# EAGLE design AVR_JTAG_1 (EAGLE 5.07)
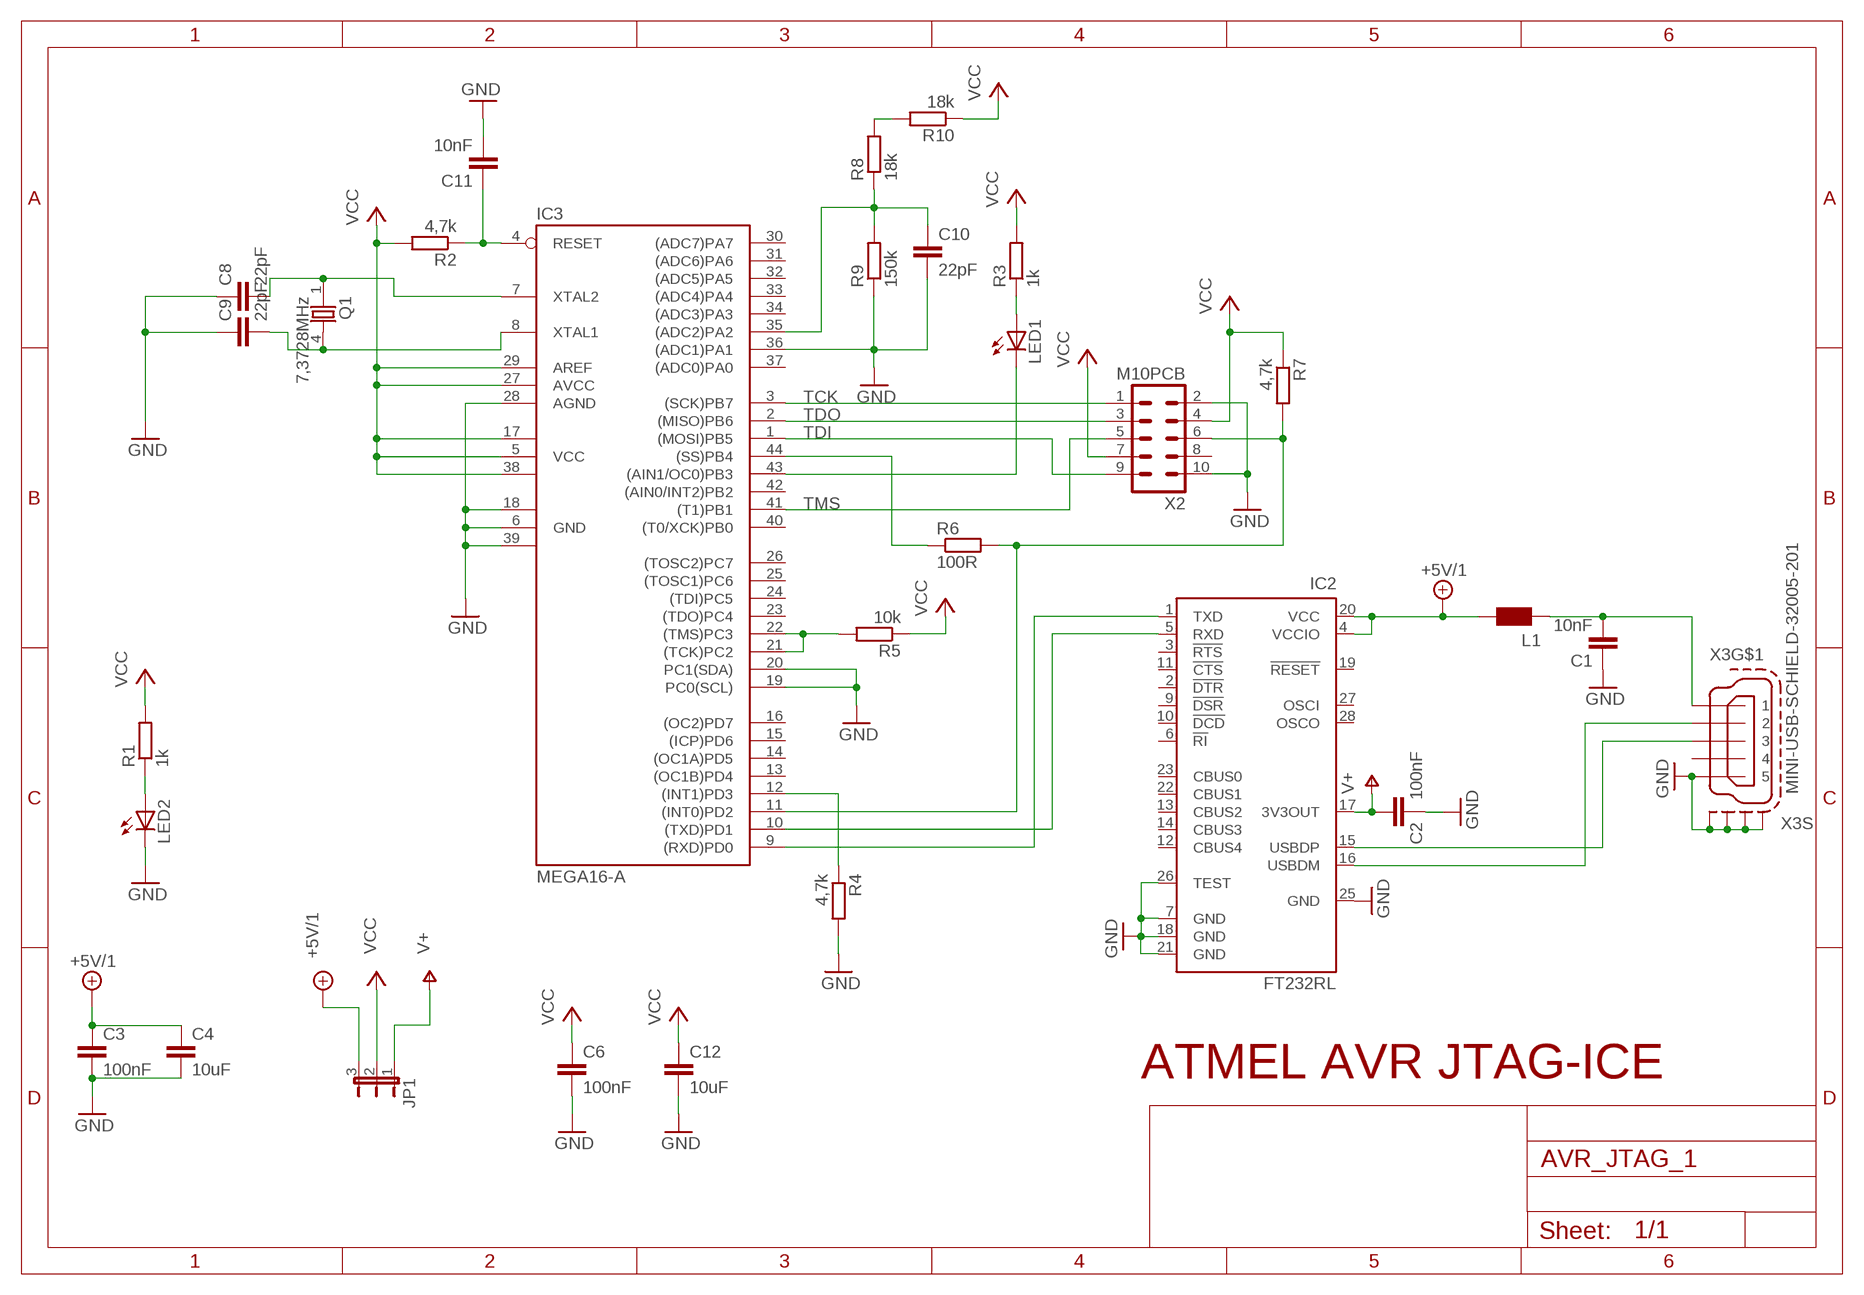
[diagram p0: schematic, sheet 1]

## Parts
C1  10nF  C-EUC1206K  [C1206K]
C2  100nF  C-EUC1206K  [C1206K]
C3  100nF  C-EUC1206K  [C1206K]
C4  10uF  C-EUC1206K  [C1206K]
C6  100nF  C-EUC1206K  [C1206K]
C8  22pF  C-EUC1206K  [C1206K]
C9  22pF  C-EUC1206K  [C1206K]
C10  22pF  C-EUC1206K  [C1206K]
C11  10nF  C-EUC1206K  [C1206K]
C12  10uF  C-EUC1206K  [C1206K]
IC2  FT232RL  [SSOP28]
IC3  MEGA16-A  [TQFP44]
JP1  JP2E  [JP2]
L1  WE-CBF_1206  [1206]
LED1  LEDP-LCC-2  [P-LCC-2]
LED2  LEDP-LCC-2  [P-LCC-2]
Q1  7,3728MHz  86SMX  [86SMX]
R1  1k  R-EU_M1206  [M1206]
R2  4,7k  R-EU_M1206  [M1206]
R3  1k  R-EU_M1206  [M1206]
R4  4,7k  R-EU_M1206  [M1206]
R5  10k  R-EU_M1206  [M1206]
R6  100R  R-EU_M1206  [M1206]
R7  4,7k  R-EU_M1206  [M1206]
R8  18k  R-EU_M1206  [M1206]
R9  150k  R-EU_M1206  [M1206]
R10  18k  R-EU_M1206  [M1206]
X2  M10PCB  ML10  [ML10]
X3  MINI-USB-SCHIELD-32005-201  [32005-201]

## Nets
+5V/1: C3.1 C4.1 IC2.4(VCCIO) IC2.20(VCC) JP1.3 L1.2
GND: C1.1 C2.1 C3.2 C4.2 C6.2 C8.1 C9.1 C10.2 C11.2 C12.2 IC2.7(GND) IC2.18(GND) IC2.21(GND) IC2.25(GND) IC2.26(TEST) IC3.6(GND) IC3.18(GND1) IC3.19(PC0(SCL)) IC3.20(PC1(SDA)) IC3.28(AGND) IC3.36((ADC1)PA1) IC3.39(GND2) LED2.C R4.2 R9.1 X2.2 X2.10 X3.5 X3.M1(S:S1) X3.M2(S:S2) X3.M3(S:S3) X3.M4(S:S4)
N$1: C9.2 IC3.8(XTAL1) Q1.4
N$2: C8.2 IC3.7(XTAL2) Q1.1
N$3: IC3.12((INT1)PD3) R4.1
N$4: IC3.43((AIN1/OC0)PB3) LED1.C
N$5: LED1.A R3.1
N$6: LED2.A R1.1
N$7: IC3.21((TCK)PC2) IC3.22((TMS)PC3) R5.2
N$8: IC2.1(TXD) IC3.9((RXD)PD0)
N$9: IC3.44((SS)PB4) R6.1
N$10: C10.1 IC3.35((ADC2)PA2) R8.1 R9.2
N$11: IC2.5(RXD) IC3.10((TXD)PD1)
N$12: R8.2 R10.2
N$13: C1.2 L1.1 X3.1
N$14: IC2.15(USBDP) X3.3
N$15: IC2.16(USBDM) X3.2
N$25: IC3.11((INT0)PD2) R6.2 R7.2 X2.6
RESET: C11.1 IC3.4(RESET) R2.1
TCK: IC3.3((SCK)PB7) X2.1
TDI: IC3.1((MOSI)PB5) X2.9
TDO: IC3.2((MISO)PB6) X2.3
TMS: IC3.41((T1)PB1) X2.5
V+: C2.2 IC2.17(3V3OUT) JP1.1
VCC: C6.1 C12.1 IC3.5(VCC) IC3.17(VCC1) IC3.27(AVCC) IC3.29(AREF) IC3.38(VCC2) JP1.2 R1.2 R2.2 R3.2 R5.1 R7.1 R10.1 X2.4 X2.7
Unconnected: IC2.2(!DTR) IC2.3(!RTS) IC2.6(!RI) IC2.9(!DSR) IC2.10(!DCD) IC2.11(!CTS) IC2.12(CBUS4) IC2.13(CBUS2) IC2.14(CBUS3) IC2.19(!RESET) IC2.22(CBUS1) IC2.23(CBUS0) IC2.27(OSCI) IC2.28(OSCO) IC3.13((OC1B)PD4) IC3.14((OC1A)PD5) IC3.15((ICP)PD6) IC3.16((OC2)PD7) IC3.23((TDO)PC4) IC3.24((TDI)PC5) IC3.25((TOSC1)PC6) IC3.26((TOSC2)PC7) IC3.30((ADC7)PA7) IC3.31((ADC6)PA6) IC3.32((ADC5)PA5) IC3.33((ADC4)PA4) IC3.34((ADC3)PA3) IC3.37((ADC0)PA0) IC3.40((T0/XCK)PB0) IC3.42((AIN0/INT2)PB2) X2.8 X3.4

## Notes on the sheet
- ATMEL AVR JTAG-ICE

## Library data of the parts
C1-C4 C6 C8-C12 = rcl:C-EU: CAPACITOR, European symbol
IC2 = ftdichip:FT232R: Source: http://www.ftdichip.com/Documents/DataSheets/DS_FT232R_v104.pdf
IC3 = atmel:MEGA16: MICROCONTROLLER 16 Kbytes FLASH 1 kbytes SRAM 512 bytes EEPROM USART 8-channel 10 bit ADC Source: avr.lbr
JP1 = jumper:JP2E: JUMPER
L1 = wuerth-elektronik:WE-CBF: SMD EMI Suppression Ferrite Beads - excellent anti-EMI properties - low DCR - impedances till 3000 ohms - rated current up to 6 A
LED1 LED2 = led:LED: LED OSRAM: - CHIPLED LG R971, LG N971, LY N971, LG Q971, LY Q971, LO R971, LY R971 LH N974, LH R974 LS Q976, LO Q976, LY Q976 LO Q996 - Hyper CHIPLED LW Q18S LB Q993, LB Q99A, LB R99A - SideLED LS A670, LO A670, LY A670, LG A670, LP A670 LB A673, LV A673, LT A673, LW A673 LH A674 LY A675 LS A676, LA A676, LO A676, LY A676, LW A676 LS A679, LY A679, LG A679 - Hyper Micro SIDELED® LS Y876, LA Y876, LO Y876, LY Y876 LT Y87S - SmartLED LW L88C, LW L88S LB L89C, LB L89S, LG L890 LS L89K, LO L89K, LY L89K LS L896, LA L896, LO L896, LY L896 - TOPLED LS T670, LO T670, LY T670, LG T670, LP T670 LSG T670, LSP T670, LSY T670, LOP T670, LYG T670 LG T671, LOG T671, LSG T671 LB T673, LV T673, LT T673, LW T673 LH T674 LS T676, LA T676, LO T676, LY T676, LB T676, LH T676, LSB T676, LW T676 LB T67C, LV T67C, LT T67C, LS T67K, LO T67K, LY T67K, LW E67C LS E67B, LA E67B, LO E67B, LY E67B, LB E67C, LV E67C, LT E67C LW T67C LS T679, LY T679, LG T679 LS T770, LO T770, LY T770, LG T770, LP T770 LB T773, LV T773, LT T773, LW T773 LH T774 LS E675, LA E675, LY E675, LS T675 LS T776, LA T776, LO T776, LY T776, LB T776 LHGB T686 LT T68C, LB T68C - Hyper Mini TOPLED® LB M676 - Mini TOPLED Santana® LG M470 LS M47K, LO M47K, LY M47K Source: http://www.osram.convergy.de LUXEON: - LUMILED® LXK2-PW12-R00, LXK2-PW12-S00, LXK2-PW14-U00, LXK2-PW14-V00 LXK2-PM12-R00, LXK2-PM12-S00, LXK2-PM14-U00 LXK2-PE12-Q00, LXK2-PE12-R00, LXK2-PE12-S00, LXK2-PE14-T00, LXK2-PE14-U00 LXK2-PB12-K00, LXK2-PB12-L00, LXK2-PB12-M00, LXK2-PB14-N00, LXK2-PB14-P00, LXK2-PB14-Q00 LXK2-PR12-L00, LXK2-PR12-M00, LXK2-PR14-Q00, LXK2-PR14-R00 LXK2-PD12-Q00, LXK2-PD12-R00, LXK2-PD12-S00 LXK2-PH12-R00, LXK2-PH12-S00 LXK2-PL12-P00, LXK2-PL12-Q00, LXK2-PL12-R00 Source: www.luxeon.com KINGBRIGHT: KA-3528ASYC Source: www.kingbright.com
Q1 = crystal:86SMX: CRYSTAL
R1-R10 = rcl:R-EU_: RESISTOR, European symbol
X2 = con-ml:ML10: HARTING
X3 = con-cypressindustries:MINI-USB-SCHIELD-: MINI USB-B Conector Source: www.cypressindustries.com

## Board
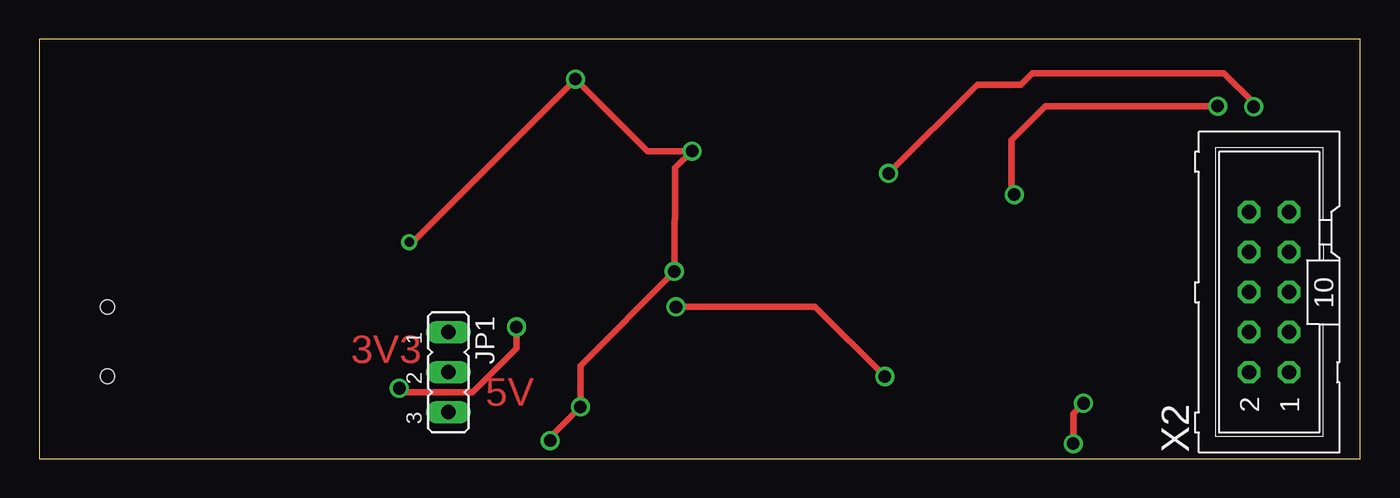
[diagram p1: board, top side]
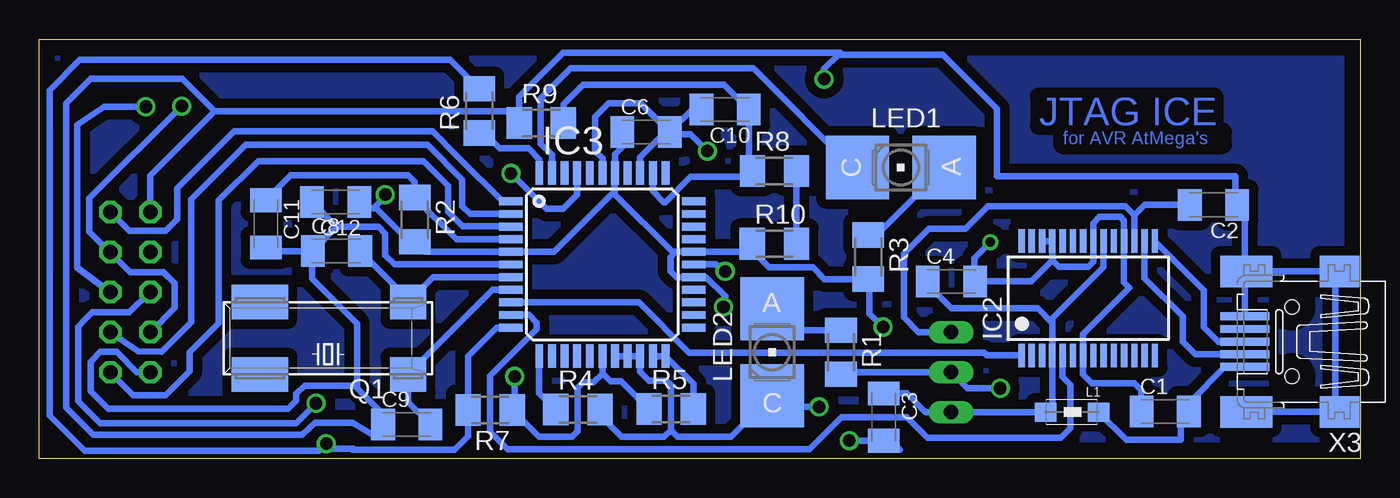
[diagram p2: board, bottom side, seen from below]

Size 83.72 x 26.56 mm. Coordinates in mm from the lower left corner, seen from the top.
Outline: 0,0 83.72,0 83.72,26.56 0,26.56 0,0
Copper layers (1*16): Top 0.035mm / dielectric 1.5mm / Bottom 0.035mm
Design rules "default": minimum track width 10mil, minimum drill 24mil, track to track 8mil, track to pad 8mil, pad to pad 8mil, via to via 8mil, smd to smd 8mil, copper to edge 40mil, drill to drill 8mil, minimum pad ring 10mil, minimum via ring 8mil, stop-mask expansion 4mil, vias tented up to drill 0mil, thermal gap 10mil

### Footprints (pad centres in the part's own frame; a part is rotated, then mirrored left to right if it is on the bottom)
C1206K = smd 1.5 x 2: 1 -1.5,0; 2 1.5,0
SSOP28 = smd 0.4 x 1.5: 1 -4.225,-3.625; 2 -3.575,-3.625; 3 -2.925,-3.625; 4 -2.275,-3.625; 5 -1.625,-3.625; 6 -0.975,-3.625; 7 -0.325,-3.625; 8 0.325,-3.625; 9 0.975,-3.625; 10 1.625,-3.625; 11 2.275,-3.625; 12 2.925,-3.625; 13 3.575,-3.625; 14 4.225,-3.625; 15 4.225,3.625; 16 3.575,3.625; 17 2.925,3.625; 18 2.275,3.625; 19 1.625,3.625; 20 0.975,3.625; 21 0.325,3.625; 22 -0.325,3.625; 23 -0.975,3.625; 24 -1.625,3.625; 25 -2.275,3.625; 26 -2.925,3.625; 27 -3.575,3.625; 28 -4.225,3.625
TQFP44 = smd 1.5 x 0.5: 1 -5.8,4; 2 -5.8,3.2; 3 -5.8,2.4; 4 -5.8,1.6; 5 -5.8,0.8; 6 -5.8,0; 7 -5.8,-0.8; 8 -5.8,-1.6; 9 -5.8,-2.4; 10 -5.8,-3.2; 11 -5.8,-4; 23 5.8,-4; 24 5.8,-3.2; 25 5.8,-2.4; 26 5.8,-1.6; 27 5.8,-0.8; 28 5.8,0; 29 5.8,0.8; 30 5.8,1.6; 31 5.8,2.4; 32 5.8,3.2; 33 5.8,4 | smd 0.5 x 1.5: 12 -4,-5.8; 13 -3.2,-5.8; 14 -2.4,-5.8; 15 -1.6,-5.8; 16 -0.8,-5.8; 17 0,-5.8; 18 0.8,-5.8; 19 1.6,-5.8; 20 2.4,-5.8; 21 3.2,-5.8; 22 4,-5.8; 34 4,5.8; 35 3.2,5.8; 36 2.4,5.8; 37 1.6,5.8; 38 0.8,5.8; 39 0,5.8; 40 -0.8,5.8; 41 -1.6,5.8; 42 -2.4,5.8; 43 -3.2,5.8; 44 -4,5.8
JP2 = drill 0.914 long: 1 -2.54,0; 2 0,0; 3 2.54,0
1206 = smd 1.35 x 1.2: 1 -1.7,0; 2 1.65,0
P-LCC-2 = smd 4 x 4: A 0,2.75; C 0,-2.75
86SMX = smd 2.286 x 2.184: 1 -5.08,-2.286; 4 -5.08,2.286 | smd 3.556 x 2.184: 2 4.318,-2.286; 3 4.318,2.286
M1206 = smd 1.6 x 2: 1 -1.4,0; 2 1.4,0
ML10 = drill 0.914 octagon: 1 -5.08,-1.27; 2 -5.08,1.27; 3 -2.54,-1.27; 4 -2.54,1.27; 5 0,-1.27; 6 0,1.27; 7 2.54,-1.27; 8 2.54,1.27; 9 5.08,-1.27; 10 5.08,1.27
32005-201 = smd 3.1 x 0.5: 1 3,1.6; 2 3,0.8; 3 3,0; 4 3,-0.8; 5 3,-1.6 | smd 2.5 x 2: M1 -3,-4.45; M2 -3,4.45 | smd 3.3 x 2: M3 2.9,4.45; M4 2.9,-4.45 | hole 0.9: 0,2.2; 0,-2.2

### Placement (x,y rotation side)
C1  12.35,2.98 0 bottom
C2  9.29,16.08 180 bottom
C3  30.19,2.62 270 bottom
C4  25.9,11.23 0 bottom
C6  45.27,20.7 0 bottom
C8  64.9,13.15 0 bottom
C9  60.44,2.16 0 bottom
C10  40.25,22.12 180 bottom
C11  69.37,14.87 270 bottom
C12  64.94,16.26 180 bottom
IC2  17.24,10.16 0 bottom
IC3  48.04,12.3 0 bottom
JP1  25.92,5.48 270 top
L1  18.28,2.94 180 bottom
LED1  29.12,18.44 270 bottom
LED2  37.27,6.74 0 bottom
Q1  65.43,7.63 180 bottom
R1  32.91,6.74 270 bottom
R2  59.93,15.14 270 bottom
R3  31.18,12.77 270 bottom
R4  49.59,3.1 0 bottom
R5  43.67,3.13 0 bottom
R6  55.85,22.03 90 bottom
R7  55.15,3.08 180 bottom
R8  37.13,18.23 0 bottom
R9  51.91,21.25 0 bottom
R10  37.13,13.61 0 bottom
X2  77.96,10.55 90 top
X3  4.32,7.41 180 bottom

### Tracks (layer width: path | path; a pad name or v marks a point on that pad's centre or on a via)
+5V/1
  Bottom 0.406: IC2.20 16.26,12.12 19.51,8.88 19.51,8.59 | 19.51,8.59 IC2.4 19.51,3.37 L1.2 JP1.3 27.54,2.94 28.73,4.13 C3.1 | C4.1 27.4,11.01 25.9,9.51 20.43,9.51 19.51,8.59
GND  (via drill 0.61, 0.8)
  Top 0.406: v32.38,1.14 32.38,1.36 v34.3,3.28 34.3,5.89 v40.24,11.83 | v40.25,11.86 40.31,18.42 v41.38,19.49 38.54,19.49 v33.98,24.05 23.65,13.72 v23.45,13.72
  Bottom 0: 19.1,12.14 17.25,12.14 17.05,12.34 17.05,12.47 16.89,12.62 16.89,14.86 16.88,14.87 16.88,14.9 16.56,15.21 16.39,15.21 16.3,15.3 15.28,15.3 15.27,15.29 15.21,15.29 14.94,15.02 14.94,11.19 14.93,11.17 14.93,11.11 14.61,10.79 14.61,10.78 17.53,7.86 17.53,5.22 17.01,4.7 14.3,4.7 14.29,4.71
  Bottom 0.254: X3.M3 1.28,2.96 1.57,2.66 | IC2.26 19.49,13.79 19.47,13.77 19.47,12.68 20.92,11.24 24.45,11.24 24.46,11.25 20.82,11.25 19.5,12.57 19.5,12.53 19.1,12.14 | 14.29,4.71 14.24,4.71 | IC3.28 40.7,12.3 v40.24,11.83
  Bottom 0.406: IC2.26 IC2.25 19.51,12.57 | 19.51,12.57 19.09,12.14 17.23,12.14 16.91,12.46 IC2.21 16.91,14.92 16.51,15.32 15.2,15.32 14.97,15.08 IC2.18 14.96,11.19 14.61,10.84 17.56,7.89 IC2.7 17.56,5.34 17,4.78 14.3,4.78 13.85,4.33 C1.1 | 29.17,0.56 29.73,1.12 C3.2 32.36,1.12 v32.38,1.14 | IC3.18 IC3.19 IC3.20 45.64,5.49 45.08,4.94 43.97,4.94 43.7,4.66 43.7,1.8 | 43.7,1.8 43.28,1.39 39.87,1.39 LED2.C 36.56,3.28 v34.3,3.28 | R4.2 48.19,2.75 46.83,1.39 44.11,1.39 43.7,1.8 | X2.10 76.7,17.93 76.69,17.93 72.61,22.02 | 63.59,4.46 61.94,2.81 C9.1 62.6,1.5 63.86,2.28 63.86,2.27 66.26,2.27 66.61,1.93 67.07,1.5 67.07,1.51 80.32,1.5 82.03,3.2 82.03,22.53 80.48,24.08 74.67,24.08 72.61,22.02 | 63.59,4.46 63.59,8.56 66.42,11.38 66.42,13.13 | 66.42,13.13 C8.1 64.87,14.68 | IC3.6 61.22,12.3 61.8,12.88 61.8,14.25 62.22,14.68 64.87,14.68 | 66.42,13.13 69.12,13.13 C11.2 | 64.87,14.68 64.87,14.69 C12.2 66.44,16.22 66.45,16.21 | C4.2 20.85,11.23 19.51,12.57 | 72.61,22.02 54.07,22.02 R9.1 53.31,22.93 50.52,25.72 32.95,25.72 33.07,25.6 | C10.2 42.35,22.12 C6.2 | C6.2 44.04,20.7 45.64,19.1 IC3.36 | IC3.39 48.04,19.04 48.49,19.49 48.49,21.66 47.64,22.52 45.61,22.52 | 45.61,22.52 45.58,22.52 C6.2 | 45.61,22.52 43.65,20.56 42.44,20.56 v41.38,19.49 | v33.98,24.05 33.98,24.69 33.07,25.6 | IC3.28 40.85,12.3 v40.25,11.86 | X2.2 77.55,5.47 78.84,6.75 79.86,6.75 80.48,6.13 80.48,4.27 79.38,3.16 67.95,3.16 67.45,3.66 67.45,4.09 66.91,4.63 63.76,4.63 63.59,4.46 | 33.07,25.6 26.45,25.6 23.02,22.17 23.02,17.89 7.92,17.89 7.92,16.08 C2.1 7.32,15.61 X3.5 7.32,11.86 X3.M4 X3.M1 1.57,11.49 1.57,2.66
  Bottom 0.406: X3.M2 X3.M3 | 24.46,11.25 24.46,12.7 v23.45,13.72
N$1
  Bottom 0.406: IC3.8 54.99,10.7 Q1.4 60.35,3.58 C9.2
N$2
  Bottom 0.406: IC3.7 58.76,11.5 Q1.1 60.35,10.11 C8.2
N$3
  Bottom 0.406: IC3.12 52.04,4.14 R4.1
N$4
  Bottom 0.406: LED1.C 32.18,18.44 38.46,24.73 50.05,24.73 51.94,22.84 51.94,19.95 51.23,19.24 IC3.43
N$5
  Bottom 0.406: R3.1 30.64,14.17 LED1.A
N$6
  Bottom 0.406: R1.1 35.92,8.14 LED2.A
N$7
  Bottom 0.406: IC3.21 IC3.22 42.27,4.73 R5.2
N$8
  Bottom 0.406: IC2.1 23.67,6.54 23.85,6.71 42.53,6.71 45.71,9.89 IC3.9
N$9
  Bottom 0.406: IC3.44 52.04,18.98 52.73,19.67 54.56,19.67 55.36,20.47 55.69,20.47 R6.1
N$10
  Bottom 0.406: R9.2 50.51,22.46 49.27,23.69 40.32,23.69 C10.1 38.75,18.45 R8.1 38.91,17.85 42.44,17.85 44.05,16.25 44.15,16.25 44.84,16.93 IC3.35
N$11
  Bottom 0.406: IC2.5 18.86,5.17 18.38,4.69 18.38,1.91 18.97,1.31 27.42,1.31 28.73,2.62 32.89,2.62 34.92,0.6 54.05,0.6 55.17,1.71 55.17,5.23 52.21,8.18 52.21,8.62 52.69,9.1 IC3.10
N$12
  Bottom 0.406: R10.2 R8.2
N$13
  Bottom 0.406: L1.1 14.82,1.19 11.37,1.19 11.37,2.47 C1.2 10.85,3.51 8.56,5.81 X3.1
N$14
  Bottom 0.406: X3.3 8.98,7.41 9.9,8.33 9.9,10.68 IC2.15
N$15
  Bottom 0.406: IC2.16 13.66,11.43 11.25,9.02 11.25,7.41 10.45,6.61 X3.2
N$16
  pour Bottom (isolate 0.61): 83.7,26.51 83.7,-0.15 -0.95,-0.19 -0.95,26.47
N$25  (via drill 0.8)
  Top 0.406: v65.54,0.94 65.54,2.85 v66.2,3.5
  Bottom 0.406: IC3.11 54.73,8.3 56.55,6.47 R7.2 56.55,1.43 57.41,0.57 63.9,0.57 63.8,0.62 65.22,0.62 v65.54,0.94 65.99,0.5 80.86,0.5 83.06,2.7 83.06,23.36 81.16,25.26 57.68,25.26 R6.2 | X2.6 76.75,10.55 78.04,9.26 80.37,9.26 80.84,8.79 | 80.84,8.79 | 80.84,8.79 81.27,8.36 81.27,3.63 79.88,2.23 67.47,2.23 v66.2,3.5
RESET
  Bottom 0.406: IC3.4 57.29,13.9 R2.1 | R2.1 60.19,16.54 | C11.1 67.8,17.95 60.35,17.95 59.93,17.53 R2.1
TCK
  Bottom 0.406: IC3.3 53.85,14.71 56.88,14.71 57.81,15.64 57.81,17.28 59.38,18.85 69.87,18.85 72.36,16.36 72.36,8.59 74.21,6.73 74.21,5.53 75.73,4 77.77,4 X2.1
TDI
  Bottom 0.406: IC3.1 54.37,16.3 57.17,19.1 58.81,20.74 71.39,20.74 74.99,17.14 74.99,15.18 75.74,14.43 78.03,14.43 X2.9
TDO
  Bottom 0.406: 79.23,8.04 X2.3 77.48,6.81 75.98,6.75 74.1,8.64 74.1,16.43 70.65,19.88 59.13,19.88 56.92,17.67 56.92,16 56.42,15.5 IC3.2
TMS  (via drill 0.8)
  Top 0.406: v76.98,22.29 76.98,22.54 75.09,24.43 62.97,24.43 62.23,23.7 59.46,23.7 v53.83,18.07
  Bottom 0.406: IC3.41 49.64,16.73 50.54,15.83 51.59,15.83 v53.83,18.07 | v76.98,22.29 79.62,22.29 81.32,21.16 81.32,12.1 X2.5
V+
  Bottom 0.406: 14.31,15.42 IC2.17 | 14.31,15.42 14.89,15.99 23.59,15.99 25.01,14.57 27.32,14.57 28.93,12.97 28.93,8.94 28,8.02 JP1.1 | JP1.1 | C2.2 13.65,16.08 14.31,15.42 | JP1.1
VCC  (via drill 0.8)
  Top 0.406: v30.24,8.34 30.24,6.98 27.47,4.2 23.06,4.2 v22.81,4.45 | v74.7,22.34 63.79,22.34 61.61,20.16 61.61,16.92 v61.8,16.73 | v40.36,9.61 49.18,9.61 v53.59,5.2
  Bottom 0.406: 43.37,13.11 43.73,12.75 43.73,11.88 43.35,11.5 IC3.27 41.46,11.5 40.23,10.28 40.23,9.74 v40.36,9.61 | 43.37,13.11 IC3.29 39.04,13.1 R10.1 38.53,13.18 37.46,12.11 34.69,12.11 33.94,11.37 31.56,11.37 | 43.37,13.11 43.6,13.11 47.26,16.77 | 47.26,16.77 47.26,18.08 IC3.38 47.24,19.27 46.77,19.75 C6.1 | 47.26,16.77 47.45,16.77 51.1,13.11 53.83,13.11 IC3.5 59.29,13.1 R2.2 60.26,13.74 61.82,15.3 | R1.2 32.77,5.48 JP1.2 24.9,4.45 v22.81,4.45 | 48.04,5.41 IC3.17 | 48.04,5.41 47.52,4.9 46.84,4.9 R5.1 | X2.4 75.14,9.54 75.14,11.1 | X2.7 77.96,11.81 77.95,11.81 | 48.04,5.41 48.04,5.39 48.59,4.84 49.26,4.84 49.6,4.5 49.6,1.74 49.97,1.37 52.04,1.37 R7.1 53.59,3.24 v53.59,5.2 | 61.82,15.3 | 61.82,15.3 62.37,15.85 62.55,15.85 | 62.55,15.85 63.03,15.85 C12.1 | 31.56,11.37 R3.2 | 31.56,11.37 31.1,10.9 31.1,9.19 v30.24,8.34 | 75.14,11.1 75.86,11.81 75.88,11.81 | 75.14,11.1 75.16,11.1 75.88,11.81 | 77.95,11.81 75.88,11.81 | 77.95,11.81 77.98,11.85 78.02,11.85 80.55,14.39 80.55,16.48 v74.7,22.34 | v61.8,16.73 61.8,16.6 62.55,15.85

### Text on the board
Top: 3V3 | 5V
Bottom: JTAG ICE | for AVR AtMega's